# Altium schematic sheet Connectors.SchDoc
size 279 x 241 mm; SheetNumber: 2; SheetTotal: 9
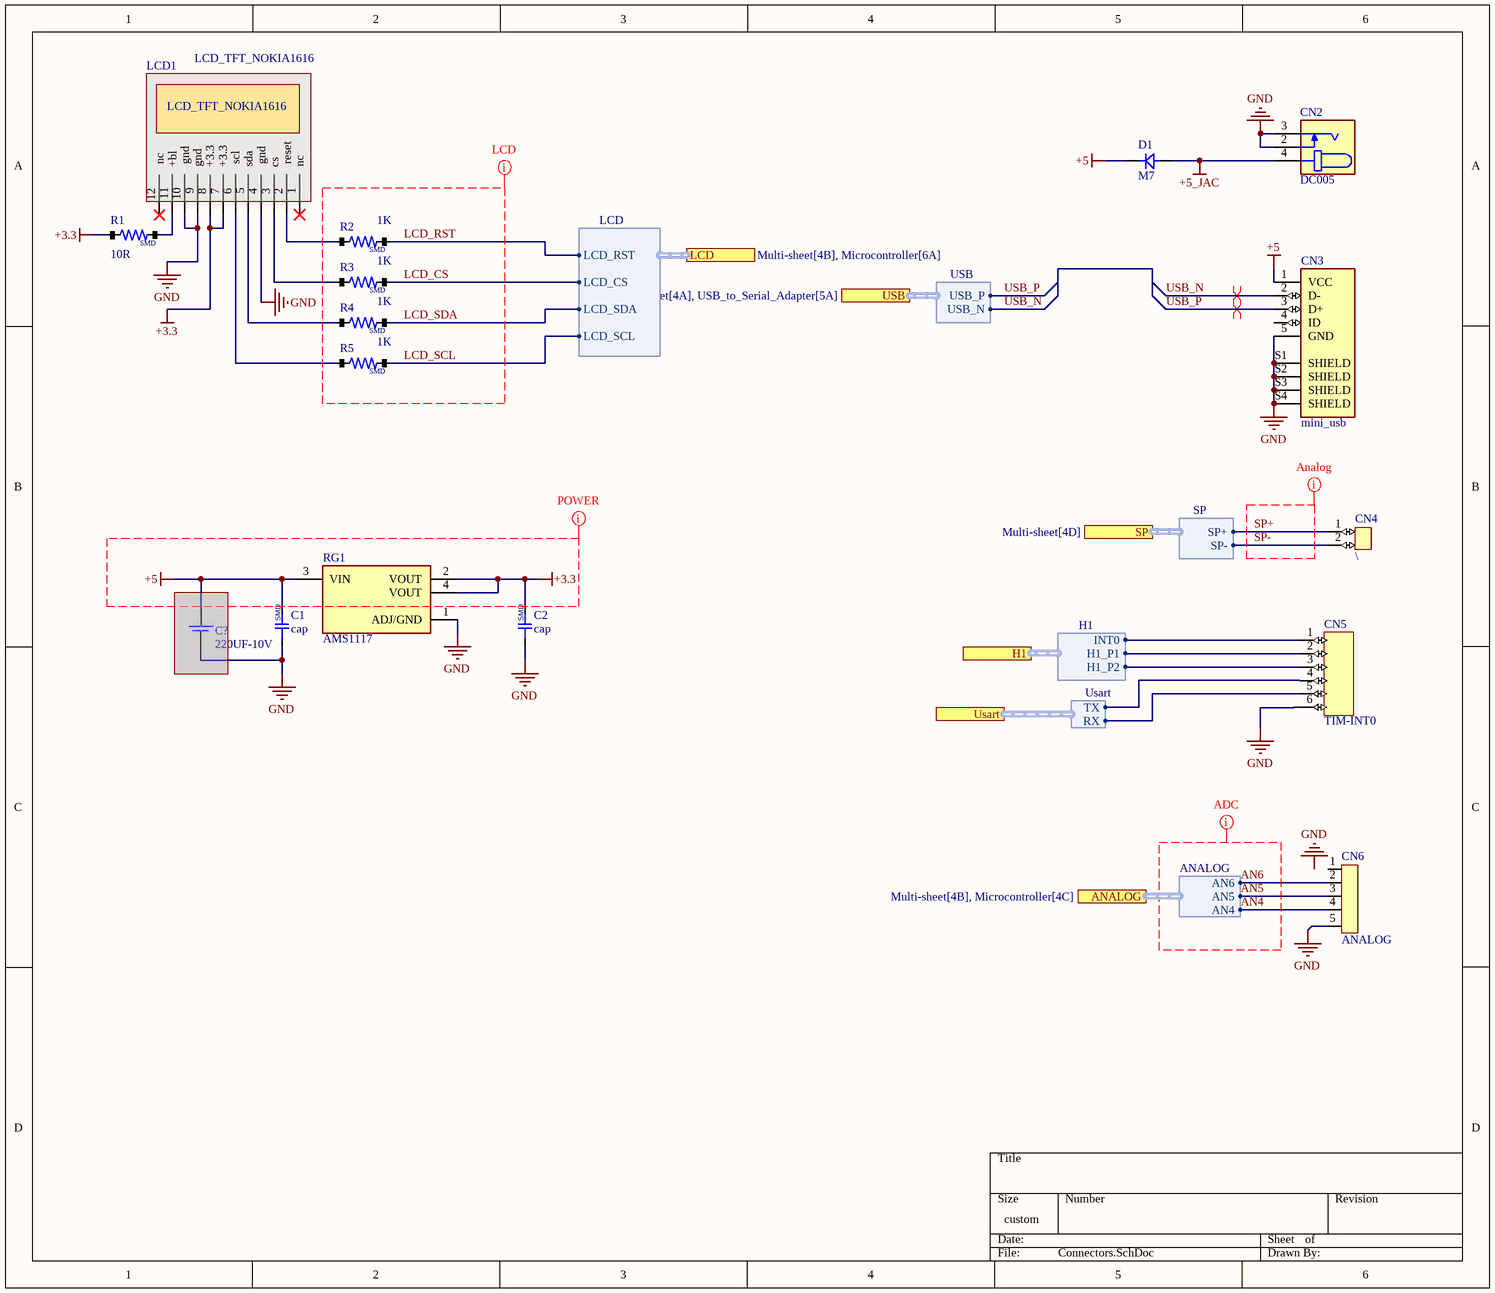
[diagram p0: Connectors.SchDoc]

## Parts
C1  cap  [CAP-0603]
C2  cap  [CAP-0603]
C?  220UF-10V  [cap/330u/16v]  (masked out: inside a compile mask, not in the netlist)
CN2  DC005  [dc005]
CN3  mini_usb  [usb_mini_smd]
CN4  \  [CONECTOR/XH/2PIN]
CN5  TIM-INT0  [pin_header_6pin]
CN6  ANALOG  [XH5]
D1  M7  [DIOD/1N4007/SMD]
LCD1  LCD_TFT_NOKIA1616  [lcd1616-flat]
R1  10R  [RES/0805]
R2  1K  [RES/0805]
R3  1K  [RES/0805]
R4  1K  [RES/0805]
R5  1K  [RES/0805]
RG1  AMS1117  [AMS1117]

## Ports
ANALOG (harness ANALOG, see Multi-sheet[4B], Microcontroller[4C]), H1 (harness H1), LCD (harness LCD, see Multi-sheet[4B], Microcontroller[6A]), SP (harness SP, see Multi-sheet[4D]), Usart (harness Usart), USB (harness USB, see Multi-sheet[4A], USB_to_Serial_Adapter[5A])

## Harnesses
USB: USB_N, USB_P
LCD: LCD_RST, LCD_CS, LCD_SDA, LCD_SCL
SP: SP-, SP+
ANALOG: AN4, AN5, AN6
H1: H1_P1, H1_P2, INT0
Usart: RX, TX

## Nets
+3.3: C2.2 LCD1.7(+3.3) LCD1.8(+3.3) R1.1 RG1.2(VOUT) RG1.4(VOUT)
+5: C1.2 CN3.1(VCC) D1.K RG1.3(VIN)
+5_JAC: CN2.4 D1.A
GND: C1.1 C2.1 CN2.2 CN2.3 CN3.5(GND) CN3.S1(SHIELD) CN3.S2(SHIELD) CN3.S3(SHIELD) CN3.S4(SHIELD) CN5.6 CN6.5 LCD1.4(gnd) LCD1.9(gnd) LCD1.10(gnd) RG1.1(ADJ/GND)
AN4: CN6.4 ; port ANALOG.AN4
AN5: CN6.3 ; port ANALOG.AN5
AN6: CN6.2 ; port ANALOG.AN6
LCD_CS: R3.2 ; port LCD.LCD_CS
LCD_RST: R2.2 ; port LCD.LCD_RST
LCD_SCL: R5.2 ; port LCD.LCD_SCL
LCD_SDA: R4.2 ; port LCD.LCD_SDA
SP+: CN4.1 ; port SP.SP+
SP-: CN4.2 ; port SP.SP-
USB_N: CN3.2(D-) ; port USB.USB_N
USB_P: CN3.3(D+) ; port USB.USB_P
NetCN5_1: CN5.1 ; port H1.INT0
NetCN5_2: CN5.2 ; port H1.H1_P1
NetCN5_3: CN5.3 ; port H1.H1_P2
NetCN5_4: CN5.4 ; port Usart.TX
NetCN5_5: CN5.5 ; port Usart.RX
NetLCD1_2: LCD1.2(reset) R2.1
NetLCD1_3: LCD1.3(cs) R3.1
NetLCD1_5: LCD1.5(sda) R4.1
NetLCD1_6: LCD1.6(scl) R5.1
NetLCD1_11: LCD1.11(+bl) R1.2

Not connected (* = marked no-connect by the designer): CN3 4(ID); CN6 1; LCD1 1(nc)* 12(_nc)*

## Layout directives
differential pair: USB_N, USB_P
net class POWER: +3.3, +5
net class LCD: LCD_CS, LCD_RST, LCD_SCL, LCD_SDA
net class Analog: SP+, SP-
net class ADC: AN4, AN5, AN6

## Notes on the sheet
- Labels drawn without touching a wire or pin: GND
- (in symbol cap_smd) SMD
- (in symbol RES/SMD) SMD

## Library data of the parts
C1 C2 = cap_smd
C? = cap-electrolit
CN2 = JAC_ADAPTOR
CN3 = usb_mini
CN4 = CONECTOR/XH/2PIN
CN5 = PIN_HEADER6
CN6 = XH5
D1 = DIOD/RECTIFIERS
LCD1 = lcd_nokia1616
R1-R5 = RES/SMD